# EAGLE design Schematic_v1 (EAGLE 9.4.2)
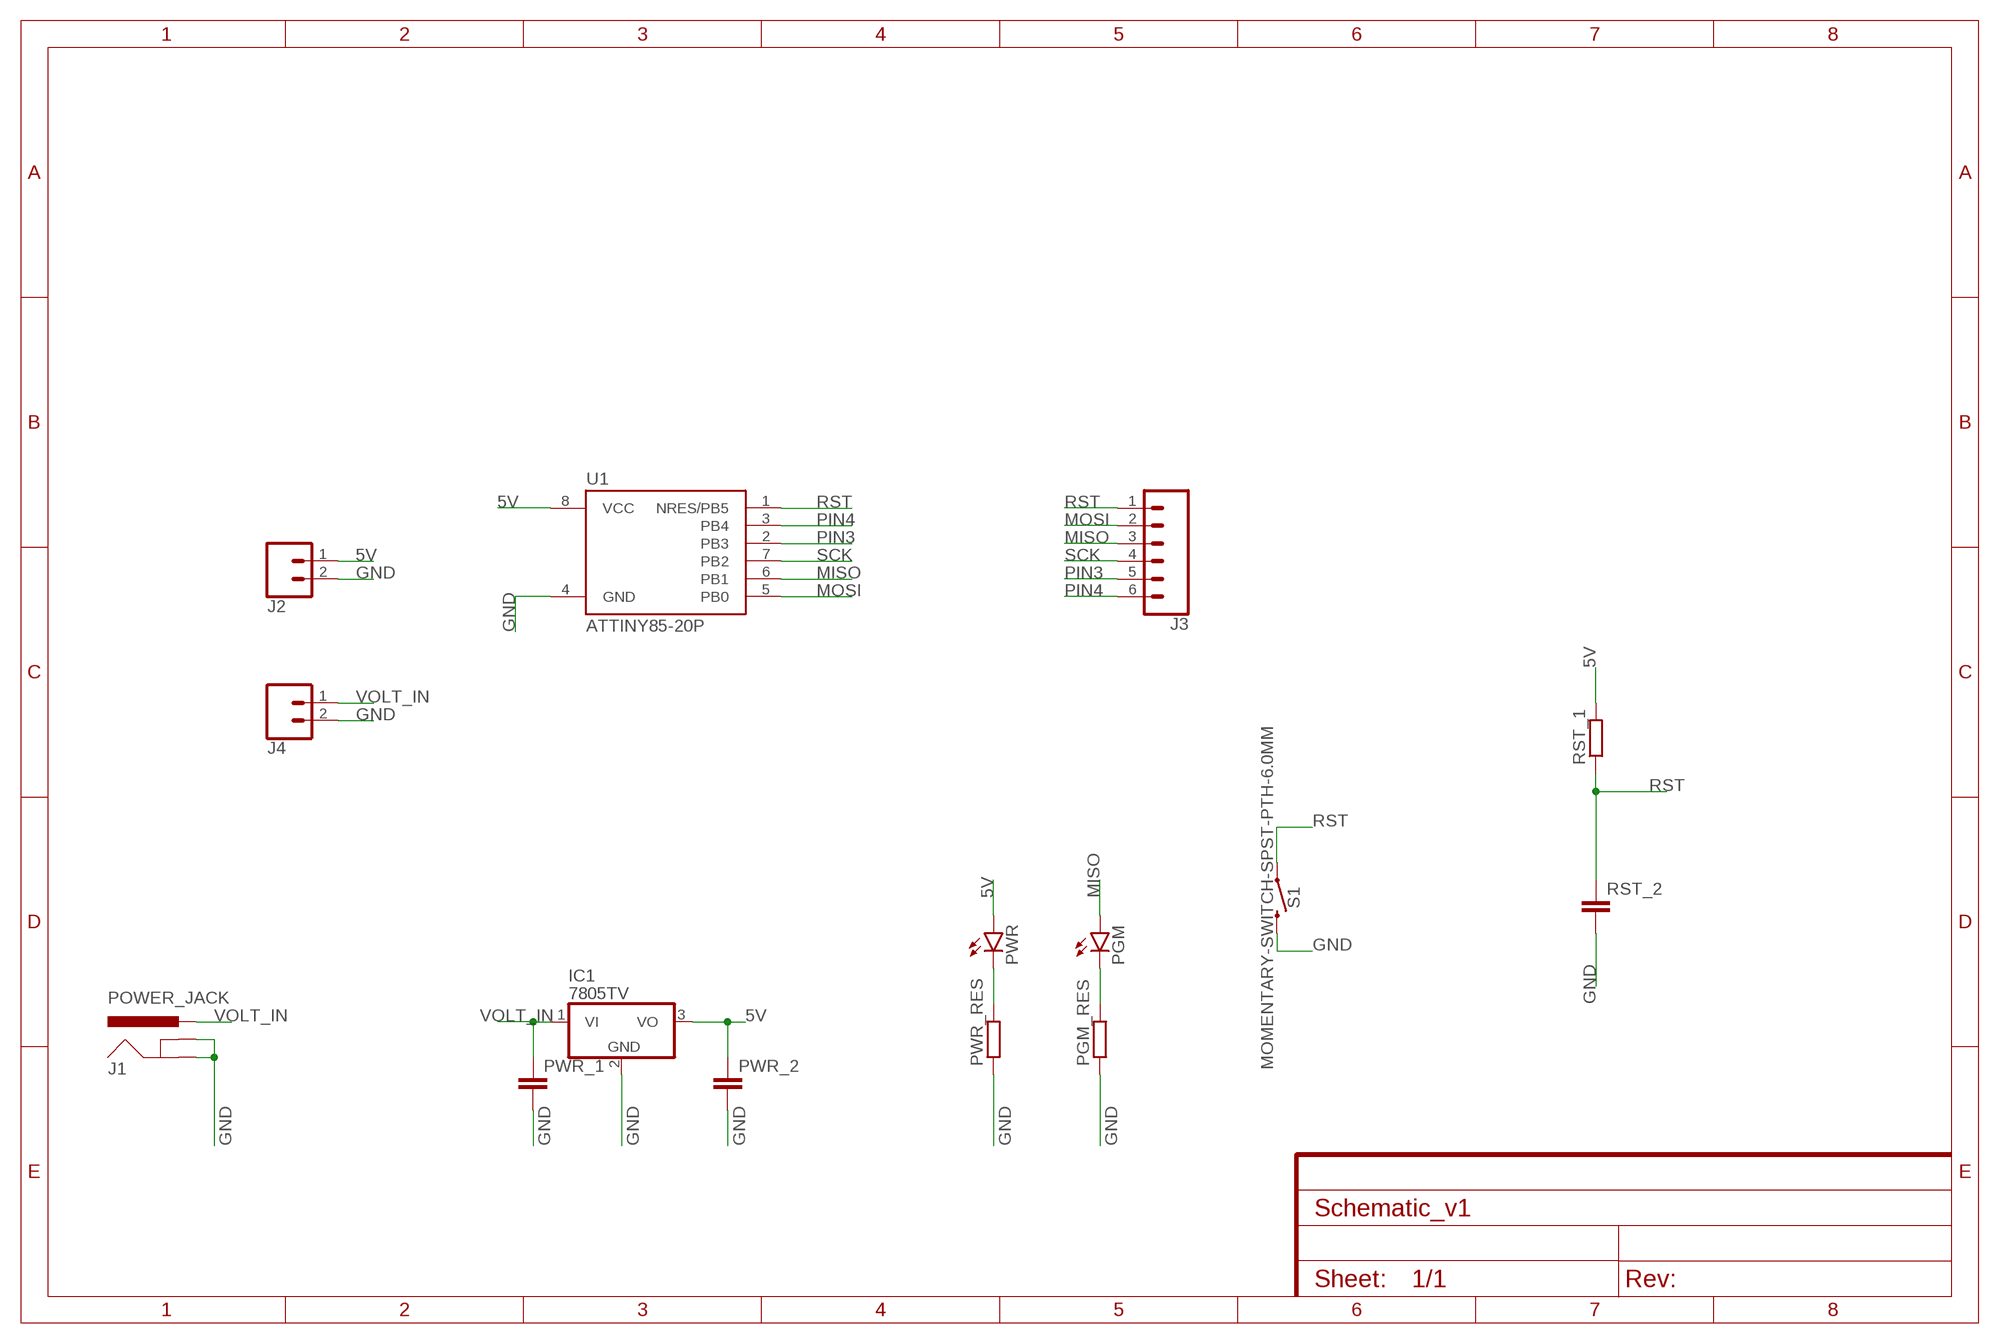
[diagram p0: schematic, sheet 1]

## Parts
IC1  7805TV  [TO220V]
J1  POWER_JACK  [POWER_JACK_PTH]
J2  CONN_021X02_NO_SILK  [1X02_NO_SILK]
J3  CONN_06NO_SILK_NO_POP  [1X06_NO_SILK]
J4  CONN_021X02_NO_SILK  [1X02_NO_SILK]
PGM  LED3MM  [LED3MM]
PGM_RES  R-EU_0207/2V  [0207/2V]
PWR  LED3MM  [LED3MM]
PWR_1  C-EU025-025X050  [C025-025X050]
PWR_2  C-EU025-025X050  [C025-025X050]
PWR_RES  R-EU_0207/2V  [0207/2V]
RST_1  R-EU_0207/2V  [0207/2V]
RST_2  C-EU025-025X050  [C025-025X050]
S1  MOMENTARY-SWITCH-SPST-PTH-6.0MM  [TACTILE_SWITCH_PTH_6.0MM]
U1  ATTINY85-20P  [PDIP08_300MIL]

## Nets
5V: IC1.3(VO) J2.1 PWR.A PWR_2.1 RST_1.2 U1.8(VCC)
GND: IC1.2(GND) J1.GND J1.GNDBREAK J2.2 J4.2 PGM_RES.1 PWR_1.2 PWR_2.2 PWR_RES.1 RST_2.2 S1.3 U1.4(GND)
MISO: J3.3 PGM.A U1.6(PB1)
MOSI: J3.2 U1.5(PB0)
N$1: PWR.K(C) PWR_RES.2
N$3: PGM.K(C) PGM_RES.2
PIN3: J3.5 U1.2(PB3)
PIN4: J3.6 U1.3(PB4)
RST: J3.1 RST_1.1 RST_2.1 S1.1 U1.1(NRES/PB5)
SCK: J3.4 U1.7(PB2)
VOLT_IN: IC1.1(VI) J1.PWR J4.1 PWR_1.1

## Library data of the parts
IC1 = linear:78*: Positive VOLTAGE REGULATOR Source: http://cache.national.com/ds/LM/LM78L05.pdf http://www.fairchildsemi.com/ds/LM/LM7805.pdf
J1 = SparkFun-Connectors:POWER_JACK: Power Jack Connector This is the standard 5.5mm barrel jack for power. The PTH is the most common, proven, reliable, footprint. The Slot footprint only works if the mill layer is transmitted to the PCB fab house so be warned. Here are the connectors we sell at SparkFun: DC Barrel Power Jack/Connector <https://www.sparkfun.com/products/119> (PRT-00119) DC Barrel Power Jack/Connector (SMD) <https://www.sparkfun.com/products/12748> (PRT-12748) DC Barrel Jack Adapter - Breadboard Compatible <https://www.sparkfun.com/products/10811> (PRT-10811) It is used on this SparkFun product (and many, many others): SparkFun RedBoard - Programmed with Arduino <https://www.sparkfun.com/products/12757> (DEV-12757) Also, if you need a mating power supply or connector, please check these out: Wall Adapter Power Supply - 9VDC 650mA <https://www.sparkfun.com/products/298> (TOL-00298) DC Barrel Jack Adapter - Male <https://www.sparkfun.com/products/10287> (PRT-10287); PROD_ID: CONN-08197
J2 J4 = SparkFun-Connectors:CONN_02: Multi connection point. Often used as Generic Header-pin footprint for 0.1 inch spaced/style header connections On any of the 0.1 inch spaced packages, you can populate with these: Break Away Headers - Straight <https://www.sparkfun.com/products/116> (PRT-00116) Break Away Male Headers - Right Angle <https://www.sparkfun.com/products/553> (PRT-00553) Female Headers <https://www.sparkfun.com/products/115> (PRT-00115) Break Away Headers - Machine Pin <https://www.sparkfun.com/products/117> (PRT-00117) Break Away Female Headers - Swiss Machine Pin <https://www.sparkfun.com/products/743> (PRT-00743) For SCREWTERMINALS and SPRING TERMINALS visit here: Screw Terimnals on SparkFun.com <https://www.sparkfun.com/search/results?term=Screw+Terminals> (5mm/3.5mm/2.54mm spacing) This device is also useful as a general connection point to wire up your design to another part of your project. Our various solder wires solder well into these plated through hole pads. Hook-Up Wire - Assortment (Stranded, 22 AWG) <https://www.sparkfun.com/products/11375> (PRT-11375) Hook-Up Wire - Assortment (Solid Core, 22 AWG) <https://www.sparkfun.com/products/11367> (PRT-11367) View the entire wire category on our website here <https://www.sparkfun.com/categories/141> Special notes: Molex polarized connector foot print use with: PRT-08233 with associated crimp pins and housings. 2.54_SCREWTERM for use with PRT-10571. 3.5mm Screw Terminal footprints for PRT-08084 5mm Screw Terminal footprints for use with PRT-08432
J3 = SparkFun-Connectors:CONN_06: Multi connection point. Often used as Generic Header-pin footprint for 0.1 inch spaced/style header connections On any of the 0.1 inch spaced packages, you can populate with these: Break Away Headers - Straight <https://www.sparkfun.com/products/116> (PRT-00116) Break Away Male Headers - Right Angle <https://www.sparkfun.com/products/553> (PRT-00553) Female Headers <https://www.sparkfun.com/products/115> (PRT-00115) Break Away Headers - Machine Pin <https://www.sparkfun.com/products/117> (PRT-00117) Break Away Female Headers - Swiss Machine Pin <https://www.sparkfun.com/products/743> (PRT-00743) Arduino Stackable Header - 6 Pin <https://www.sparkfun.com/products/9280> (PRT-09280) For SCREWTERMINALS and SPRING TERMINALS visit here: Screw Terimnals on SparkFun.com <https://www.sparkfun.com/search/results?term=Screw+Terminals> (5mm/3.5mm/2.54mm spacing) This device is also useful as a general connection point to wire up your design to another part of your project. Our various solder wires solder well into these plated through hole pads. Hook-Up Wire - Assortment (Stranded, 22 AWG) <https://www.sparkfun.com/products/11375> (PRT-11375) Hook-Up Wire - Assortment (Solid Core, 22 AWG) <https://www.sparkfun.com/products/11367> (PRT-11367) View the entire wire category on our website here <https://www.sparkfun.com/categories/141>
PGM PWR = led:LED: LED OSRAM: - CHIPLED LG R971, LG N971, LY N971, LG Q971, LY Q971, LO R971, LY R971 LH N974, LH R974 LS Q976, LO Q976, LY Q976 LO Q996 - Hyper CHIPLED LW Q18S LB Q993, LB Q99A, LB R99A - SideLED LS A670, LO A670, LY A670, LG A670, LP A670 LB A673, LV A673, LT A673, LW A673 LH A674 LY A675 LS A676, LA A676, LO A676, LY A676, LW A676 LS A679, LY A679, LG A679 - Hyper Micro SIDELED® LS Y876, LA Y876, LO Y876, LY Y876 LT Y87S - SmartLED LW L88C, LW L88S LB L89C, LB L89S, LG L890 LS L89K, LO L89K, LY L89K LS L896, LA L896, LO L896, LY L896 - TOPLED LS T670, LO T670, LY T670, LG T670, LP T670 LSG T670, LSP T670, LSY T670, LOP T670, LYG T670 LG T671, LOG T671, LSG T671 LB T673, LV T673, LT T673, LW T673 LH T674 LS T676, LA T676, LO T676, LY T676, LB T676, LH T676, LSB T676, LW T676 LB T67C, LV T67C, LT T67C, LS T67K, LO T67K, LY T67K, LW E67C LS E67B, LA E67B, LO E67B, LY E67B, LB E67C, LV E67C, LT E67C LW T67C LS T679, LY T679, LG T679 LS T770, LO T770, LY T770, LG T770, LP T770 LB T773, LV T773, LT T773, LW T773 LH T774 LS E675, LA E675, LY E675, LS T675 LS T776, LA T776, LO T776, LY T776, LB T776 LHGB T686 LT T68C, LB T68C - Hyper Mini TOPLED® LB M676 - Mini TOPLED Santana® LG M470 LS M47K, LO M47K, LY M47K Source: http://www.osram.convergy.de LUXEON: - LUMILED® LXK2-PW12-R00, LXK2-PW12-S00, LXK2-PW14-U00, LXK2-PW14-V00 LXK2-PM12-R00, LXK2-PM12-S00, LXK2-PM14-U00 LXK2-PE12-Q00, LXK2-PE12-R00, LXK2-PE12-S00, LXK2-PE14-T00, LXK2-PE14-U00 LXK2-PB12-K00, LXK2-PB12-L00, LXK2-PB12-M00, LXK2-PB14-N00, LXK2-PB14-P00, LXK2-PB14-Q00 LXK2-PR12-L00, LXK2-PR12-M00, LXK2-PR14-Q00, LXK2-PR14-R00 LXK2-PD12-Q00, LXK2-PD12-R00, LXK2-PD12-S00 LXK2-PH12-R00, LXK2-PH12-S00 LXK2-PL12-P00, LXK2-PL12-Q00, LXK2-PL12-R00 Source: www.luxeon.com KINGBRIGHT: KA-3528ASYC Source: www.kingbright.com
PGM_RES PWR_RES RST_1 = rcl:R-EU_: RESISTOR, European symbol; SPICEPREFIX: R
PWR_1 PWR_2 RST_2 = rcl:C-EU: CAPACITOR, European symbol; SPICEPREFIX: C
S1 = SparkFun-Switches:MOMENTARY-SWITCH-SPST: Momentary Switch (Pushbutton) - SPST Normally-open (NO) SPST momentary switches (buttons, pushbuttons). Variants PTH-12MM - 12mm square, through-hole Momentary Pushbutton Switch - 12mm Square <https://www.sparkfun.com/products/9190> (COM-09190) PTH-6.0MM, PTH-6.0MM-KIT - 6.0mm square, through-hole Mini Pushbutton Switch <https://www.sparkfun.com/products/97> (COM-00097) KIT package intended for soldering kit's - only one side of pads' copper is exposed. PTH-RIGHT-ANGLE-KIT - Right-angle, through-hole Right Angle Tactile Button <https://www.sparkfun.com/products/10791> - Used on SparkFun BigTime Watch Kit <https://www.sparkfun.com/products/11734> SMD-12MM - 12mm square, surface-mount Tactile Button - SMD (12mm) <https://www.sparkfun.com/products/12993> (COM-12993) Used on SparkFun PicoBoard <https://www.sparkfun.com/products/11888> SMD-4.5MM - 4.5mm Square Trackball Switch Used on SparkFun Blackberry Trackballer Breakout <https://www.sparkfun.com/products/13169> SMD-4.6MMX2.8MM - 4.60mm x 2.80mm, surface mount Used on SparkFun SAMD21 Mini Breakout <https://www.sparkfun.com/products/13664> SMD-5.2MM, SMD-5.2-REDUNDANT - 5.2mm square, surface-mount Mini Pushbutton Switch - SMD <https://www.sparkfun.com/products/8720> (COM-08720) Used on Arduino Pro Mini <https://www.sparkfun.com/products/11114> REDUNDANT package connects both switch circuits together SMD-6.0X3.5MM - 6.0 x 3.5mm, surface mount Momentary Reset Switch SMD <https://www.sparkfun.com/products/8229> (COM-08229) SMD-6.2MM-TALL - 6.2mm square, surface mount Tactile Button - SMD (6mm) <https://www.sparkfun.com/products/12992> Used on SparkFun Digital Sandbox <https://www.sparkfun.com/products/12651> SMD-RIGHT-ANGLE - Right-angle, surface mount Used on SparkFun Block for Intel® Edison - Arduino <https://www.sparkfun.com/products/13036>; PROD_ID: SWCH-08441; SF_SKU: COM-00097
U1 = _hhn_attiny25_45_85:ATTINY85*: ATMEL ATtiny 85 Packages: P = PDIP 08 30mil S = SOIC 08 EIAJ 208mil Technologies Note: for complete ordering code (temp. range, finish, tape&reel etc.) see www.atmel.com • Supply Voltage: V = (1.8…5.5)V | [blank] = (2.7…5.5)V • Speed: 10 = 10 MHz | 20 = 20 MHz Author: Dipl.-Ing. FH Rainer Bayer HHN Hochschule Heilbronn (Heilbronn University), rainer.bayer@hs-heilbronn.de Ingenieurbüro ing-rb, mail@ing-rb.de

## Board
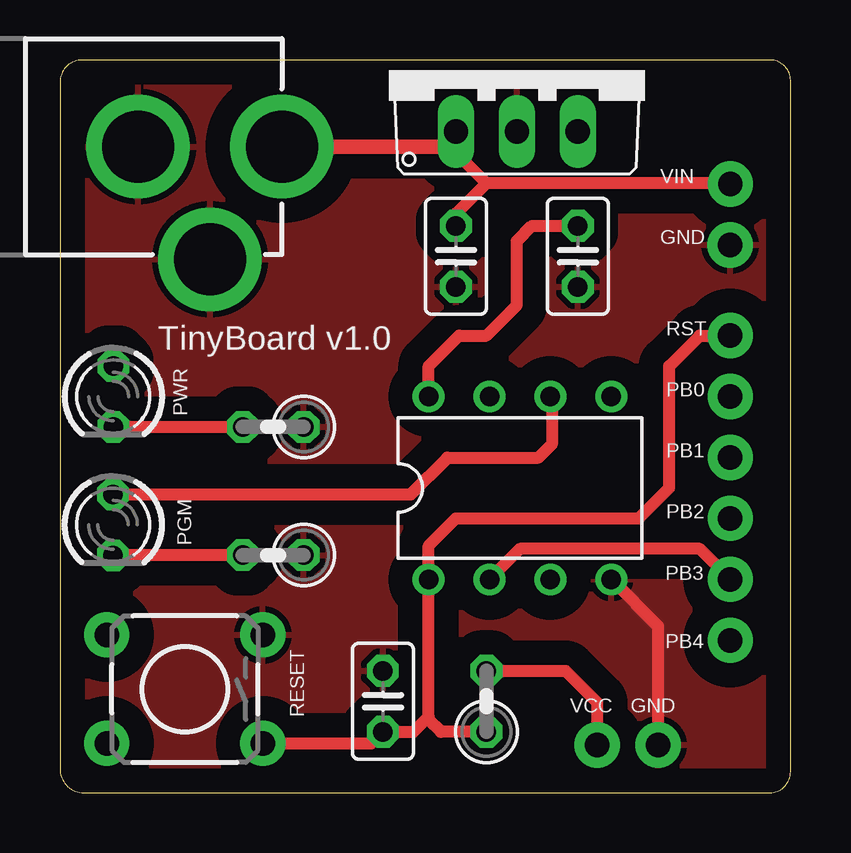
[diagram p1: board, top side]
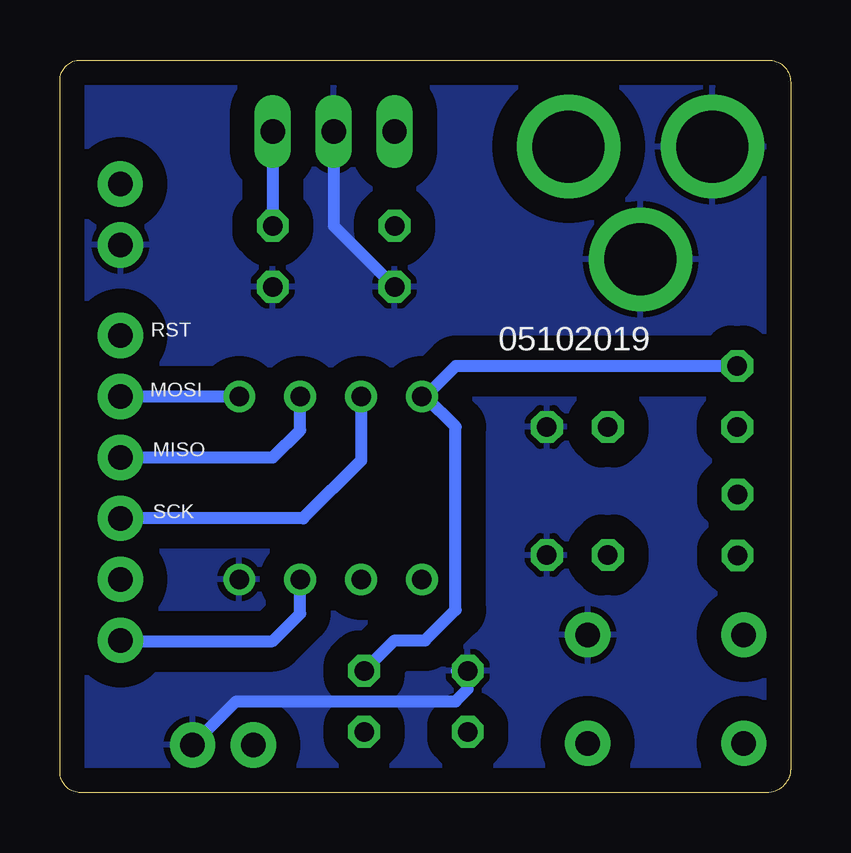
[diagram p2: board, bottom side, seen from below]

Size 30.46 x 30.53 mm. Coordinates in mm from the lower left corner, seen from the top.
Outline: 0,29.6 0,0.99 arc90 0.99,0 29.59,0 arc90 30.46,0.87 30.46,29.69 arc90 29.62,30.53 0.93,30.53 arc90 0,29.6
Copper layers (1*16): Top 0.035mm / dielectric 1.5mm / Bottom 0.035mm
Design rules "default": minimum track width 6mil, minimum drill 0.35mm, track to track 6mil, track to pad 6mil, pad to pad 6mil, via to via 6mil, smd to smd 6mil, copper to edge 40mil, drill to drill 6mil, minimum pad ring 10mil, minimum via ring 8mil, stop-mask expansion 4mil, vias tented up to drill 0mil, thermal gap 10mil

### Footprints (pad centres in the part's own frame; a part is rotated, then mirrored left to right if it is on the bottom)
TO220V = drill 1.016 long: 1 -2.54,-2.54; 2 0,-2.54; 3 2.54,-2.54
POWER_JACK_PTH = drill 2.997 pad 4.318: GND 0,7.7; GNDBREAK 4.7,10.7; PWR 0,13.7
1X02_NO_SILK = drill 1.016 pad 1.88: 1 0,0; 2 2.54,0
1X06_NO_SILK = drill 1.016 pad 1.88: 1 0,0; 2 2.54,0; 3 5.08,0; 4 7.62,0; 5 10.16,0; 6 12.7,0
LED3MM = drill 0.813 octagon: A -1.27,0; K 1.27,0
0207/2V = drill 0.813 octagon: 1 -1.27,0; 2 1.27,0
C025-025X050 = drill 0.813 octagon: 1 -1.27,0; 2 1.27,0
TACTILE_SWITCH_PTH_6.0MM = drill 1.016 pad 1.88: 1 -3.251,2.261; 2 3.251,2.261; 3 -3.251,-2.261; 4 3.251,-2.261
PDIP08_300MIL = drill 0.813: 1 -3.81,-3.81; 2 -1.27,-3.81; 3 1.27,-3.81; 4 3.81,-3.81; 5 3.81,3.81; 6 1.27,3.81; 7 -1.27,3.81; 8 -3.81,3.81

### Placement (x,y rotation side)
IC1  19.05,30.1 0 top
J1  -4.45,26.92 270 top
J2  22.4,1.99 0 top
J3  27.94,19.05 270 top
J4  27.95,25.36 269.8 top
PGM  2.21,11.16 270 top
PGM_RES  8.89,9.91 180 top
PWR  2.22,16.51 270 top
PWR_1  16.51,22.35 270 top
PWR_2  21.59,22.35 270 top
PWR_RES  8.89,15.24 180 top
RST_1  17.78,3.81 90 top
RST_2  13.46,3.81 90 top
S1  5.21,4.32 180 top
U1  19.18,12.7 0 top

### Tracks (layer width: path | path; a pad name or v marks a point on that pad's centre or on a via)
5V
  Top 0.508: J2.1 22.4,3.77 21.08,5.08 RST_1.2 | U1.8 15.37,17.78 16.64,19.05 17.78,19.05 19.05,20.32 19.05,22.99 19.68,23.62 PWR_2.1
  Bottom 0.508: RST_1.2 16.51,6.35 15.24,6.35 13.97,7.62 13.97,15.24 15.24,16.51 | 15.24,16.51 U1.8 | PWR.A 13.97,17.78 15.24,16.51 | IC1.3 PWR_2.1
GND
  Top 0.508: U1.4 24.94,6.94 J2.2
  Bottom 0.508: 13.93,5.08 RST_2.2 13.46,4.32 13.97,3.81 23.12,3.81 J2.2 | IC1.2 19.05,23.62 PWR_1.2
  pour Top (isolate 1.016): 1.27,30.48 29.21,30.48 arc-90 30.48,29.21 30.48,1.27 arc-90 29.21,0 1.27,0 arc-90 0,1.27 0,29.21
  pour Bottom (isolate 1.016): 7.62,30.48 29.21,30.48 arc-90 30.48,29.21 30.48,1.27 arc-90 29.21,0 2.54,0 1.27,0 arc-90 0,1.27 0,29.21 arc-90 1.27,30.48
MISO
  Top 0.508: PGM.A 14.62,12.43 16.15,13.96 19.95,13.96 20.5,14.51 20.5,16.45 U1.6
  Bottom 0.508: J3.3 21.59,13.97 20.45,15.11 U1.6
MOSI
  Bottom 0.508: U1.5 J3.2
N$1
  Top 0.508: PWR.K PWR_RES.2
N$3
  Top 0.508: PGM_RES.2 7.61,9.89 PGM.K
PIN3
  Top 0.508: U1.2 19.18,10.16 26.67,10.16 J3.5
PIN4
  Bottom 0.508: J3.6 27.91,6.32 21.59,6.32 20.45,7.46 U1.3
RST
  Top 0.508: S1.1 12.98,2.06 RST_2.1 14.73,2.54 15.37,3.17 | J3.1 26.67,19.05 25.4,17.78 25.4,12.7 24.13,11.43 16.51,11.43 15.37,10.29 U1.1 15.37,3.17 | RST_1.1 15.88,2.54 15.37,3.05 15.37,3.17
SCK
  Bottom 0.508: U1.7 17.91,13.84 20.32,11.43 J3.4
VOLT_IN
  Top 0.508: J4.1 27.91,25.4 17.78,25.4 | 17.78,25.4 16.51,26.67 IC1.1 | 17.78,25.4 16.51,24.13 PWR_1.1
  Top 0.61: 15.88,26.92 IC1.1 | J1.PWR 15.88,26.92 | 16.51,26.67 16.26,26.92 15.88,26.92

### Text on the board
tPlace: TinyBoard v1.0 | RST | PB0 | PWR | PB1 | PB2 | PGM | PB3 | PB4 | VCC | GND | RESET
bPlace: RST | MOSI | MISO | SCK
tNames: VIN | GND
bNames: 05102019